# EAGLE design NinjaLantern-171001 (EAGLE 6.6.0)
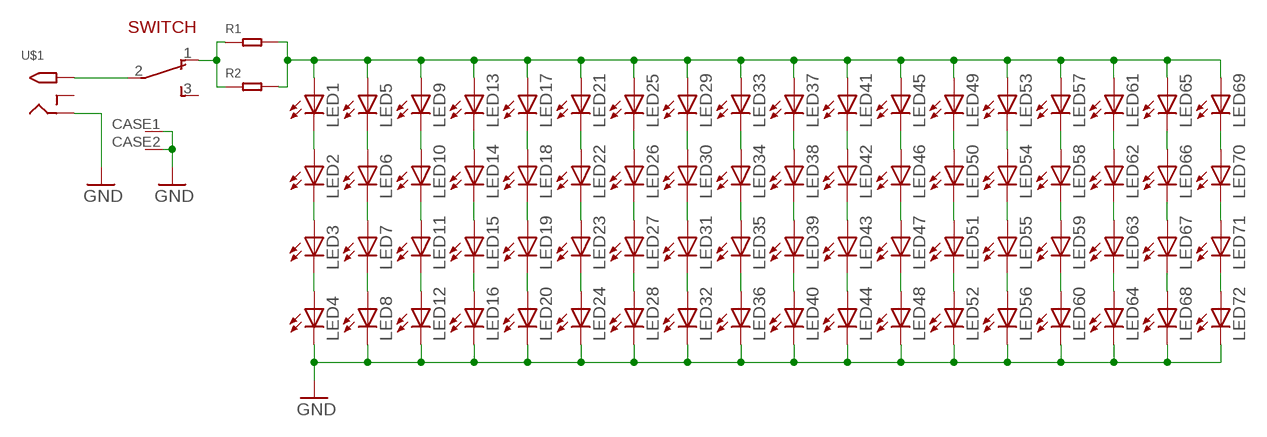
[diagram p0: schematic, sheet 1]

## Parts
LED1  LED5MM  [LED5MM]
LED2  LED5MM  [LED5MM]
LED3  LED5MM  [LED5MM]
LED4  LED5MM  [LED5MM]
LED5  LED5MM  [LED5MM]
LED6  LED5MM  [LED5MM]
LED7  LED5MM  [LED5MM]
LED8  LED5MM  [LED5MM]
LED9  LED5MM  [LED5MM]
LED10  LED5MM  [LED5MM]
LED11  LED5MM  [LED5MM]
LED12  LED5MM  [LED5MM]
LED13  LED5MM  [LED5MM]
LED14  LED5MM  [LED5MM]
LED15  LED5MM  [LED5MM]
LED16  LED5MM  [LED5MM]
LED17  LED5MM  [LED5MM]
LED18  LED5MM  [LED5MM]
LED19  LED5MM  [LED5MM]
LED20  LED5MM  [LED5MM]
LED21  LED5MM  [LED5MM]
LED22  LED5MM  [LED5MM]
LED23  LED5MM  [LED5MM]
LED24  LED5MM  [LED5MM]
LED25  LED5MM  [LED5MM]
LED26  LED5MM  [LED5MM]
LED27  LED5MM  [LED5MM]
LED28  LED5MM  [LED5MM]
LED29  LED5MM  [LED5MM]
LED30  LED5MM  [LED5MM]
LED31  LED5MM  [LED5MM]
LED32  LED5MM  [LED5MM]
LED33  LED5MM  [LED5MM]
LED34  LED5MM  [LED5MM]
LED35  LED5MM  [LED5MM]
LED36  LED5MM  [LED5MM]
LED37  LED5MM  [LED5MM]
LED38  LED5MM  [LED5MM]
LED39  LED5MM  [LED5MM]
LED40  LED5MM  [LED5MM]
LED41  LED5MM  [LED5MM]
LED42  LED5MM  [LED5MM]
LED43  LED5MM  [LED5MM]
LED44  LED5MM  [LED5MM]
LED45  LED5MM  [LED5MM]
LED46  LED5MM  [LED5MM]
LED47  LED5MM  [LED5MM]
LED48  LED5MM  [LED5MM]
LED49  LED5MM  [LED5MM]
LED50  LED5MM  [LED5MM]
LED51  LED5MM  [LED5MM]
LED52  LED5MM  [LED5MM]
LED53  LED5MM  [LED5MM]
LED54  LED5MM  [LED5MM]
LED55  LED5MM  [LED5MM]
LED56  LED5MM  [LED5MM]
LED57  LED5MM  [LED5MM]
LED58  LED5MM  [LED5MM]
LED59  LED5MM  [LED5MM]
LED60  LED5MM  [LED5MM]
LED61  LED5MM  [LED5MM]
LED62  LED5MM  [LED5MM]
LED63  LED5MM  [LED5MM]
LED64  LED5MM  [LED5MM]
LED65  LED5MM  [LED5MM]
LED66  LED5MM  [LED5MM]
LED67  LED5MM  [LED5MM]
LED68  LED5MM  [LED5MM]
LED69  LED5MM  [LED5MM]
LED70  LED5MM  [LED5MM]
LED71  LED5MM  [LED5MM]
LED72  LED5MM  [LED5MM]
R1  DIP-RES-100R-5%-1/4W(PR-D2.3XL6.5MM)  [PR-D2.3XL6.5MM]
R2  DIP-RES-100R-5%-1/4W(PR-D2.3XL6.5MM)  [PR-D2.3XL6.5MM]
SWITCH  4MS1R202M6QES  [4MS1R202M6QES]
U$1  2.1MMJACKTHM  [PJ-102A]

## Nets
GND: LED4.K(C) LED8.K(C) LED12.K(C) LED16.K(C) LED20.K(C) LED24.K(C) LED28.K(C) LED32.K(C) LED36.K(C) LED40.K(C) LED44.K(C) LED48.K(C) LED52.K(C) LED56.K(C) LED60.K(C) LED64.K(C) LED68.K(C) LED72.K(C) U$1.RING
N$1: LED3.K(C) LED4.A
N$2: LED2.K(C) LED3.A
N$3: LED1.K(C) LED2.A
N$5: SWITCH.2 U$1.TIP
N$6: LED7.K(C) LED8.A
N$7: LED6.K(C) LED7.A
N$8: LED5.K(C) LED6.A
N$9: R1.1 R2.1 SWITCH.1
N$10: LED1.A LED5.A LED9.A LED13.A LED17.A LED21.A LED25.A LED29.A LED33.A LED37.A LED41.A LED45.A LED49.A LED53.A LED57.A LED61.A LED65.A LED69.A R1.2 R2.2
N$11: LED11.K(C) LED12.A
N$12: LED10.K(C) LED11.A
N$13: LED9.K(C) LED10.A
N$16: LED15.K(C) LED16.A
N$17: LED14.K(C) LED15.A
N$18: LED13.K(C) LED14.A
N$21: LED19.K(C) LED20.A
N$22: LED18.K(C) LED19.A
N$23: LED17.K(C) LED18.A
N$26: LED23.K(C) LED24.A
N$27: LED22.K(C) LED23.A
N$28: LED21.K(C) LED22.A
N$31: LED27.K(C) LED28.A
N$32: LED26.K(C) LED27.A
N$33: LED25.K(C) LED26.A
N$36: LED31.K(C) LED32.A
N$37: LED30.K(C) LED31.A
N$38: LED29.K(C) LED30.A
N$41: LED35.K(C) LED36.A
N$42: LED34.K(C) LED35.A
N$43: LED33.K(C) LED34.A
N$46: LED39.K(C) LED40.A
N$47: LED38.K(C) LED39.A
N$48: LED37.K(C) LED38.A
N$51: LED43.K(C) LED44.A
N$52: LED42.K(C) LED43.A
N$53: LED41.K(C) LED42.A
N$56: LED47.K(C) LED48.A
N$57: LED46.K(C) LED47.A
N$58: LED45.K(C) LED46.A
N$61: LED51.K(C) LED52.A
N$62: LED50.K(C) LED51.A
N$63: LED49.K(C) LED50.A
N$66: LED55.K(C) LED56.A
N$67: LED54.K(C) LED55.A
N$68: LED53.K(C) LED54.A
N$71: LED59.K(C) LED60.A
N$72: LED58.K(C) LED59.A
N$73: LED57.K(C) LED58.A
N$76: LED63.K(C) LED64.A
N$77: LED62.K(C) LED63.A
N$78: LED61.K(C) LED62.A
N$81: LED67.K(C) LED68.A
N$82: LED66.K(C) LED67.A
N$83: LED65.K(C) LED66.A
N$86: LED71.K(C) LED72.A
N$87: LED70.K(C) LED71.A
N$88: LED69.K(C) LED70.A
Unconnected: SWITCH.3 SWITCH.CASE1 SWITCH.CASE2 U$1.RING_SW

## Library data of the parts
LED1-LED72 = led:LED: LED OSRAM: - CHIPLED LG R971, LG N971, LY N971, LG Q971, LY Q971, LO R971, LY R971 LH N974, LH R974 LS Q976, LO Q976, LY Q976 LO Q996 - Hyper CHIPLED LW Q18S LB Q993, LB Q99A, LB R99A - SideLED LS A670, LO A670, LY A670, LG A670, LP A670 LB A673, LV A673, LT A673, LW A673 LH A674 LY A675 LS A676, LA A676, LO A676, LY A676, LW A676 LS A679, LY A679, LG A679 - Hyper Micro SIDELED® LS Y876, LA Y876, LO Y876, LY Y876 LT Y87S - SmartLED LW L88C, LW L88S LB L89C, LB L89S, LG L890 LS L89K, LO L89K, LY L89K LS L896, LA L896, LO L896, LY L896 - TOPLED LS T670, LO T670, LY T670, LG T670, LP T670 LSG T670, LSP T670, LSY T670, LOP T670, LYG T670 LG T671, LOG T671, LSG T671 LB T673, LV T673, LT T673, LW T673 LH T674 LS T676, LA T676, LO T676, LY T676, LB T676, LH T676, LSB T676, LW T676 LB T67C, LV T67C, LT T67C, LS T67K, LO T67K, LY T67K, LW E67C LS E67B, LA E67B, LO E67B, LY E67B, LB E67C, LV E67C, LT E67C LW T67C LS T679, LY T679, LG T679 LS T770, LO T770, LY T770, LG T770, LP T770 LB T773, LV T773, LT T773, LW T773 LH T774 LS E675, LA E675, LY E675, LS T675 LS T776, LA T776, LO T776, LY T776, LB T776 LHGB T686 LT T68C, LB T68C - Hyper Mini TOPLED® LB M676 - Mini TOPLED Santana® LG M470 LS M47K, LO M47K, LY M47K Source: http://www.osram.convergy.de LUXEON: - LUMILED® LXK2-PW12-R00, LXK2-PW12-S00, LXK2-PW14-U00, LXK2-PW14-V00 LXK2-PM12-R00, LXK2-PM12-S00, LXK2-PM14-U00 LXK2-PE12-Q00, LXK2-PE12-R00, LXK2-PE12-S00, LXK2-PE14-T00, LXK2-PE14-U00 LXK2-PB12-K00, LXK2-PB12-L00, LXK2-PB12-M00, LXK2-PB14-N00, LXK2-PB14-P00, LXK2-PB14-Q00 LXK2-PR12-L00, LXK2-PR12-M00, LXK2-PR14-Q00, LXK2-PR14-R00 LXK2-PD12-Q00, LXK2-PD12-R00, LXK2-PD12-S00 LXK2-PH12-R00, LXK2-PH12-S00 LXK2-PL12-P00, LXK2-PL12-Q00, LXK2-PL12-R00 Source: www.luxeon.com KINGBRIGHT: KA-3528ASYC Source: www.kingbright.com
R1 R2 = Seeed-Resistor:DIP-RES-100R-5%-1/4W(PR-D2.3XL6.5MM): 301020017; MPN: FHCFR-1/4W-101J; VALUE: 100R
SWITCH = PCR-Switch:4MS1R202M6QES
U$1 = adafruit:2.1MMJACK: 2.1mm x 5.5mm THM DC jack with internal switch. Digikey part #PJ-102A, 4UCON part #05537 2.1mm x 5.5mm SMT DC jack with internal switch. Digikey part #PJ-002A-SMT, 4UCON part #03267 By microbuilder.eu & adafruit.com

## Board
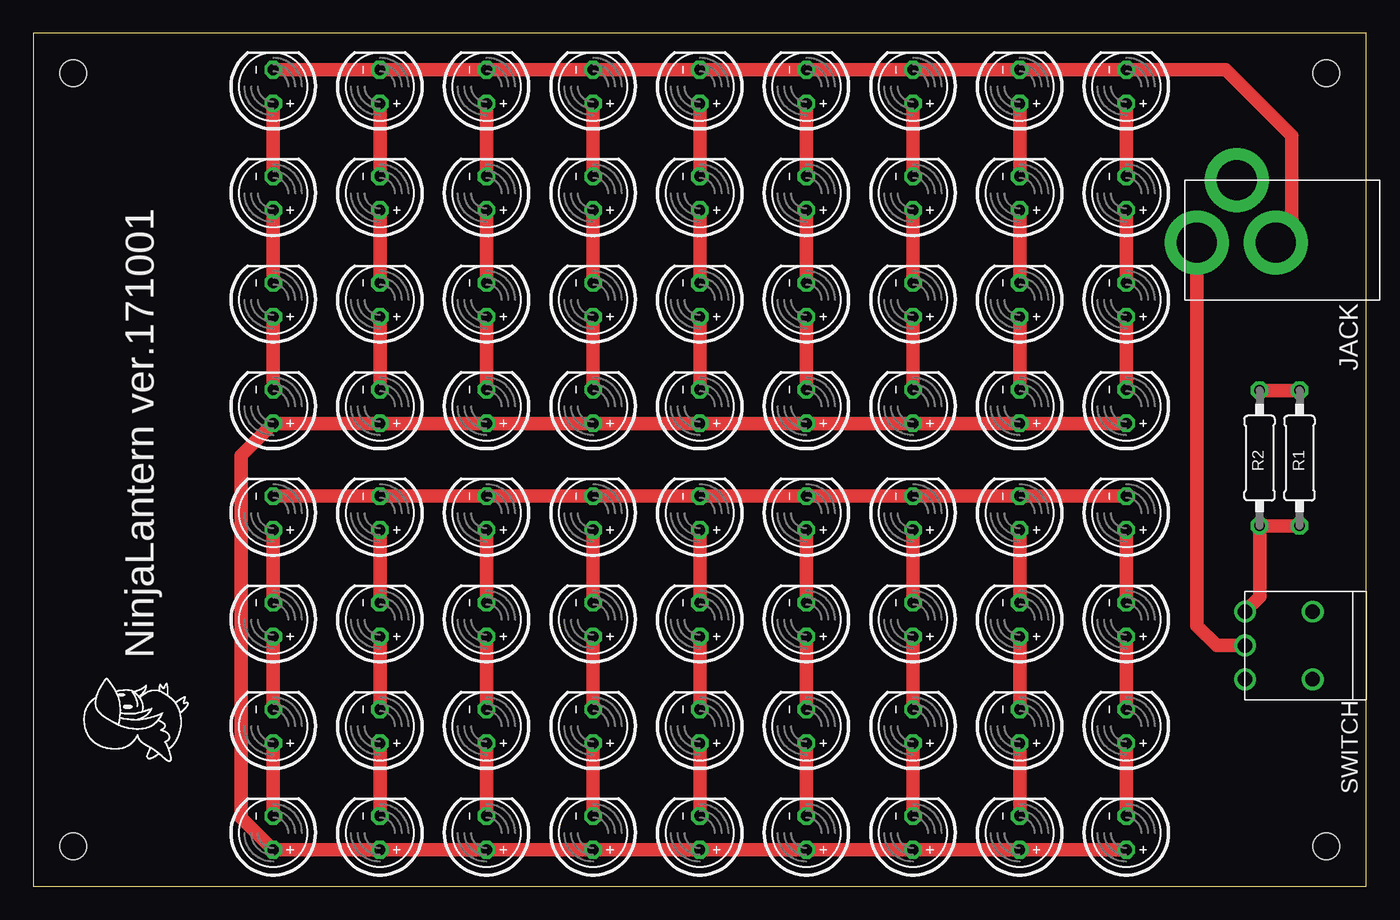
[diagram p1: board, top side]
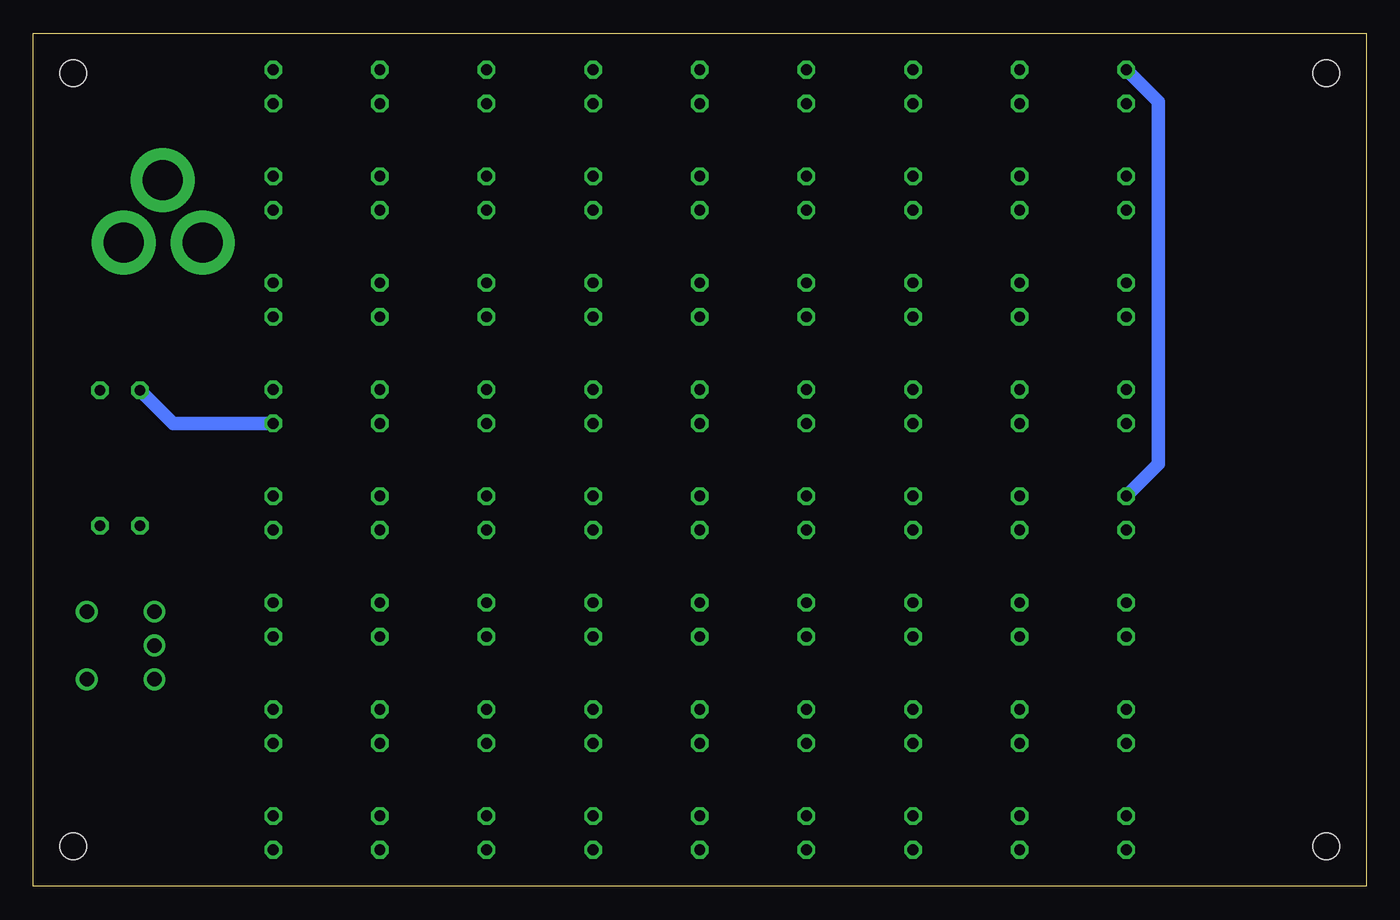
[diagram p2: board, bottom side, seen from below]

Size 100 x 64 mm. Coordinates in mm from the lower left corner, seen from the top.
Outline: 0,0 100,0 100,64 0,64 0,0
Copper layers (1*16): Top 0.035mm / dielectric 1.5mm / Bottom 0.035mm
Design rules "SeeedStudio_2layer_DRU_no_angle_20140221": minimum track width 6mil, minimum drill 12mil, track to track 6mil, track to pad 6mil, pad to pad 6mil, via to via 6mil, smd to smd 0mil, copper to edge 10mil, drill to drill 10mil, minimum pad ring 10mil, minimum via ring 6mil, stop-mask expansion 2mil, vias tented up to drill 100mil, thermal gap 10mil
Holes 2 mm at 97,61 97,3 3,3 3,61

### Footprints (pad centres in the part's own frame; a part is rotated, then mirrored left to right if it is on the bottom)
LED5MM = drill 0.813 octagon: A -1.27,0; K 1.27,0
PR-D2.3XL6.5MM = drill 0.813 octagon: 1 -4.953,0; 2 5.207,0
4MS1R202M6QES = drill 1.09: 1 2.54,9.09; 2 0,9.09; 3 -2.54,9.09; CASE1 2.54,4.01; CASE2 -2.54,4.01
PJ-102A = drill 3 pad 4.8: RING 0.1,-3.39; RING_SW -4.6,-6.29; TIP 0.1,-9.29

### Placement (x,y rotation side)
LED1  18,36 90 top
LED2  18,44 90 top
LED3  18,52 90 top
LED4  18,60 90 top
LED5  26,36 90 top
LED6  26,44 90 top
LED7  26,52 90 top
LED8  26,60 90 top
LED9  34,36 90 top
LED10  34,44 90 top
LED11  34,52 90 top
LED12  34,60 90 top
LED13  42,36 90 top
LED14  42,44 90 top
LED15  42,52 90 top
LED16  42,60 90 top
LED17  50,36 90 top
LED18  50,44 90 top
LED19  50,52 90 top
LED20  50,60 90 top
LED21  58,36 90 top
LED22  58,44 90 top
LED23  58,52 90 top
LED24  58,60 90 top
LED25  66,36 90 top
LED26  66,44 90 top
LED27  66,52 90 top
LED28  66,60 90 top
LED29  74,36 90 top
LED30  74,44 90 top
LED31  74,52 90 top
LED32  74,60 90 top
LED33  82,36 90 top
LED34  82,44 90 top
LED35  82,52 90 top
LED36  82,60 90 top
LED37  18,4 90 top
LED38  18,12 90 top
LED39  18,20 90 top
LED40  18,28 90 top
LED41  26,4 90 top
LED42  26,12 90 top
LED43  26,20 90 top
LED44  26,28 90 top
LED45  34,4 90 top
LED46  34,12 90 top
LED47  34,20 90 top
LED48  34,28 90 top
LED49  42,4 90 top
LED50  42,12 90 top
LED51  42,20 90 top
LED52  42,28 90 top
LED53  50,4 90 top
LED54  50,12 90 top
LED55  50,20 90 top
LED56  50,28 90 top
LED57  58,4 90 top
LED58  58,12 90 top
LED59  58,20 90 top
LED60  58,28 90 top
LED61  66,4 90 top
LED62  66,12 90 top
LED63  66,20 90 top
LED64  66,28 90 top
LED65  74,4 90 top
LED66  74,12 90 top
LED67  74,20 90 top
LED68  74,28 90 top
LED69  82,4 90 top
LED70  82,12 90 top
LED71  82,20 90 top
LED72  82,28 90 top
R1  95,32 90 top
R2  92,32 90 top
SWITCH  100,18.06 90 top
U$1  96.6,48.4 270 top
U$2  [TORI_0.25]  11.77,9.19 90 top

### Tracks (layer width: path | path; a pad name or v marks a point on that pad's centre or on a via)
GND
  Top 1.016: LED4.K LED8.K LED12.K LED16.K LED20.K LED24.K LED28.K LED32.K LED36.K 89.46,61.27 94.42,56.31 94.42,49.52 U$1.RING | LED40.K LED44.K LED48.K LED52.K LED56.K LED60.K LED64.K LED68.K LED72.K
  Bottom 1.016: LED40.K 15.58,31.69 15.58,58.85 LED4.K
N$1
  Top 1.016: LED3.K LED4.A
N$2
  Top 1.016: LED2.K LED3.A
N$3
  Top 1.016: LED1.K LED2.A
N$5
  Top 1.016: U$1.TIP 87.31,19.53 88.78,18.06 SWITCH.2
N$6
  Top 1.016: LED8.A LED7.K
N$7
  Top 1.016: LED7.A LED6.K
N$8
  Top 1.016: LED6.A LED5.K
N$9
  Top 1.016: SWITCH.1 92,21.7 R2.1 R1.1
N$10
  Top 1.016: LED33.A LED29.A LED25.A LED21.A LED17.A LED13.A LED9.A LED5.A LED1.A 15.58,32.31 15.58,5.15 LED37.A LED41.A LED45.A LED49.A LED53.A LED57.A LED61.A LED65.A LED69.A | R2.2 R1.2
  Bottom 1.016: R2.2 89.52,34.73 LED33.A
N$11
  Top 1.016: LED11.K LED12.A
N$12
  Top 1.016: LED10.K LED11.A
N$13
  Top 1.016: LED9.K LED10.A
N$16
  Top 1.016: LED15.K LED16.A
N$17
  Top 1.016: LED15.A LED14.K
N$18
  Top 1.016: LED14.A LED13.K
N$21
  Top 1.016: LED19.K LED20.A
N$22
  Top 1.016: LED18.K LED19.A
N$23
  Top 1.016: LED17.K LED18.A
N$26
  Top 1.016: LED24.A LED23.K
N$27
  Top 1.016: LED23.A LED22.K
N$28
  Top 1.016: LED22.A LED21.K
N$31
  Top 1.016: LED27.K LED28.A
N$32
  Top 1.016: LED26.K LED27.A
N$33
  Top 1.016: LED25.K LED26.A
N$36
  Top 1.016: LED32.A LED31.K
N$37
  Top 1.016: LED31.A LED30.K
N$38
  Top 1.016: LED30.A LED29.K
N$41
  Top 1.016: LED36.A LED35.K
N$42
  Top 1.016: LED35.A LED34.K
N$43
  Top 1.016: LED34.A LED33.K
N$46
  Top 1.016: LED40.A LED39.K
N$47
  Top 1.016: LED39.A LED38.K
N$48
  Top 1.016: LED38.A LED37.K
N$51
  Top 1.016: LED44.A LED43.K
N$52
  Top 1.016: LED42.K LED43.A
N$53
  Top 1.016: LED41.K LED42.A
N$56
  Top 1.016: LED48.A LED47.K
N$57
  Top 1.016: LED47.A LED46.K
N$58
  Top 1.016: LED46.A LED45.K
N$61
  Top 1.016: LED51.K LED52.A
N$62
  Top 1.016: LED50.K LED51.A
N$63
  Top 1.016: LED49.K LED50.A
N$66
  Top 1.016: LED56.A LED55.K
N$67
  Top 1.016: LED55.A LED54.K
N$68
  Top 1.016: LED54.A LED53.K
N$71
  Top 1.016: LED60.A LED59.K
N$72
  Top 1.016: LED58.K LED59.A
N$73
  Top 1.016: LED57.K LED58.A
N$76
  Top 1.016: LED64.A LED63.K
N$77
  Top 1.016: LED62.K LED63.A
N$78
  Top 1.016: LED61.K LED62.A
N$81
  Top 1.016: LED68.A LED67.K
N$82
  Top 1.016: LED67.A LED66.K
N$83
  Top 1.016: LED66.A LED65.K
N$86
  Top 1.016: LED72.A LED71.K
N$87
  Top 1.016: LED71.A LED70.K
N$88
  Top 1.016: LED70.A LED69.K

### Text on the board
tPlace: JACK | NinjaLantern ver.171001